# Altium schematic sheet Termination.SchDoc
size A4; SheetNumber: 2; SheetTotal: 2
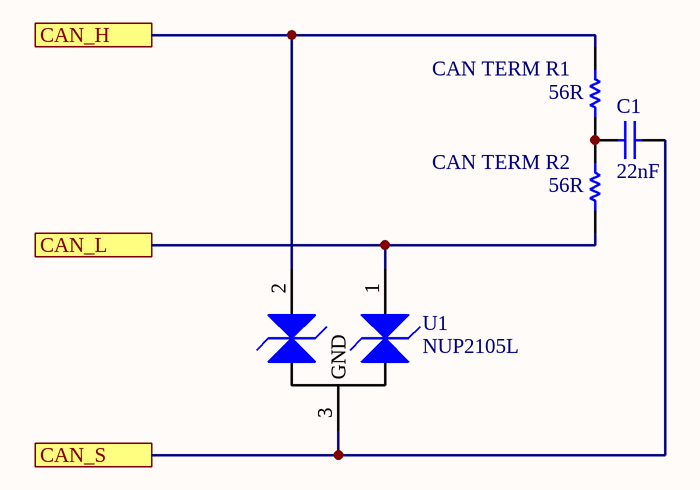
[diagram p0: Termination.SchDoc]

## Parts
C1  22nF  [0805]
CAN_TERM_R1  56R  [0805]
CAN_TERM_R2  56R  [0805]
U1  NUP2105L  [ON SOT-23]

## Ports
CAN_H, CAN_L, CAN_S

## Nets
CAN_H: CAN_TERM_R1.2 U1.2(CAN_L) ; port CAN_H
CAN_L: CAN_TERM_R2.1 U1.1(CAN_H) ; port CAN_L
CAN_S: C1.2 U1.3(GND) ; port CAN_S
NetC1_1: C1.1 CAN_TERM_R1.1 CAN_TERM_R2.2

## Library data of the parts
C1 = GCM21B5C1H223JA16L: Manufacturer: muRata; Tolerance: ±5%; Material: C0G, NP0; Rated Voltage: 50V; Part Number: GCM21B5C1H223JA16L; Value: 22nF; Digikey Part Number: 490-5318-1-ND
CAN_TERM_R1 CAN_TERM_R2 = RC0805FR0756RL: Manufacturer: YAGEO; Tolerance: 0.01; Rated Voltage: 0.125W; Part Number: RC0805FR0756RL; Value: 56R; Material: FR-07; Digikey Part Number: 311-56.0CRCT-ND
U1 = NUP2105L: Dual Line CAN Bus Protector; Manufacturer: ON Semiconductor; Part Number: NUP2105L; Digikey Part Number: NUP2105LT1GOSCT-ND; Digikey Link: https://www.digikey.com/product-detail/en/on-semiconductor/NUP2105LT1G/NUP2105LT1GOSCT-ND/1485001